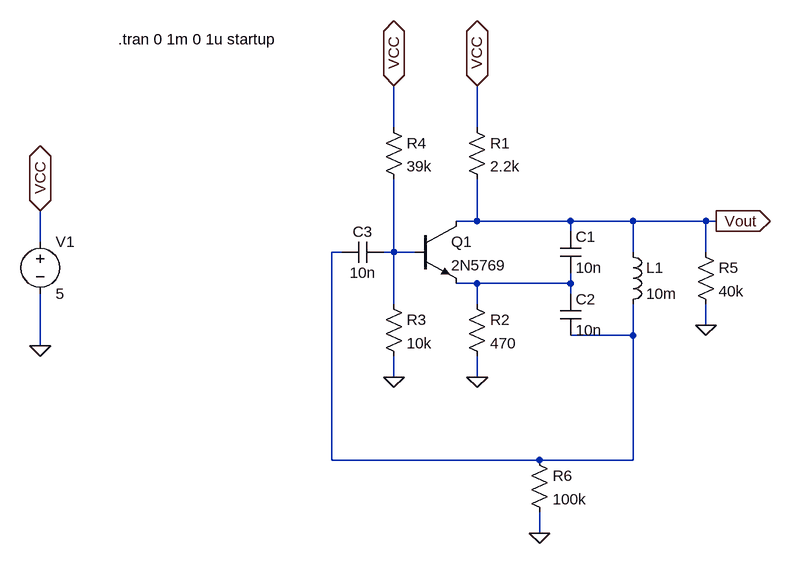
[diagram p0: schematic Col-pit_metal_dec.asc]
Col-pit_metal_dec.asc, the LTspice schematic file:
Version 4
SHEET 1 880 680
WIRE 144 -32 144 -96
WIRE 272 -32 272 -96
WIRE 272 112 272 48
WIRE 272 112 240 112
WIRE 416 112 272 112
WIRE 512 112 416 112
WIRE 624 112 512 112
WIRE 640 112 624 112
WIRE 416 128 416 112
WIRE -400 144 -400 96
WIRE 64 160 48 160
WIRE 144 160 144 48
WIRE 144 160 128 160
WIRE 176 160 144 160
WIRE 512 160 512 112
WIRE 624 160 624 112
WIRE 272 208 240 208
WIRE 416 208 416 192
WIRE 416 208 272 208
WIRE 416 224 416 208
WIRE 144 240 144 160
WIRE 272 240 272 208
WIRE 624 272 624 240
WIRE 512 288 512 240
WIRE 512 288 416 288
WIRE -400 304 -400 224
WIRE 144 352 144 320
WIRE 272 352 272 320
WIRE 48 480 48 160
WIRE 368 480 48 480
WIRE 512 480 512 288
WIRE 512 480 368 480
WIRE 368 592 368 560
FLAG -400 304 0
FLAG 272 352 0
FLAG 272 -96 VCC
IOPIN 272 -96 BiDir
FLAG -400 96 VCC
IOPIN -400 96 BiDir
FLAG 640 112 Vout
IOPIN 640 112 Out
FLAG 144 352 0
FLAG 144 -96 VCC
IOPIN 144 -96 BiDir
FLAG 624 272 0
FLAG 368 592 0
SYMBOL cap 400 128 R0
SYMATTR InstName C1
SYMATTR Value 10n
SYMBOL cap 400 224 R0
SYMATTR InstName C2
SYMATTR Value 10n
SYMBOL cap 128 144 R90
WINDOW 0 0 32 VBottom 2
WINDOW 3 32 32 VTop 2
SYMATTR InstName C3
SYMATTR Value 10n
SYMBOL ind 496 144 R0
SYMATTR InstName L1
SYMATTR Value 10m
SYMBOL res 256 -48 R0
SYMATTR InstName R1
SYMATTR Value 2.2k
SYMBOL res 256 224 R0
SYMATTR InstName R2
SYMATTR Value 470
SYMBOL voltage -400 128 R0
WINDOW 123 0 0 Left 2
WINDOW 39 0 0 Left 2
SYMATTR InstName V1
SYMATTR Value 5
SYMBOL res 128 224 R0
SYMATTR InstName R3
SYMATTR Value 10k
SYMBOL res 128 -48 R0
SYMATTR InstName R4
SYMATTR Value 39k
SYMBOL res 608 144 R0
SYMATTR InstName R5
SYMATTR Value 40k
SYMBOL res 352 464 R0
SYMATTR InstName R6
SYMATTR Value 100k
SYMBOL npn2 176 112 R0
SYMATTR InstName Q1
SYMATTR Value 2N5769
TEXT -280 -168 Left 2 !.tran 0 1m 0 1u startup

The netlist it stands for:
* Col-pit_metal_dec.asc
C1 Vout N003 10n
C2 N003 N001 10n
C3 N002 N001 10n
L1 Vout N001 10m
R1 VCC Vout 2.2k
R2 N003 0 470
V1 VCC 0 5
R3 N002 0 10k
R4 VCC N002 39k
R5 Vout 0 40k
R6 N001 0 100k
Q1 Vout N002 N003 0 2N5769
.model NPN NPN
.model PNP PNP
.lib standard.bjt
.tran 0 1m 0 1u startup
.backanno
.end